# EAGLE design 401_led_1x1 (EAGLE 7.4.0)
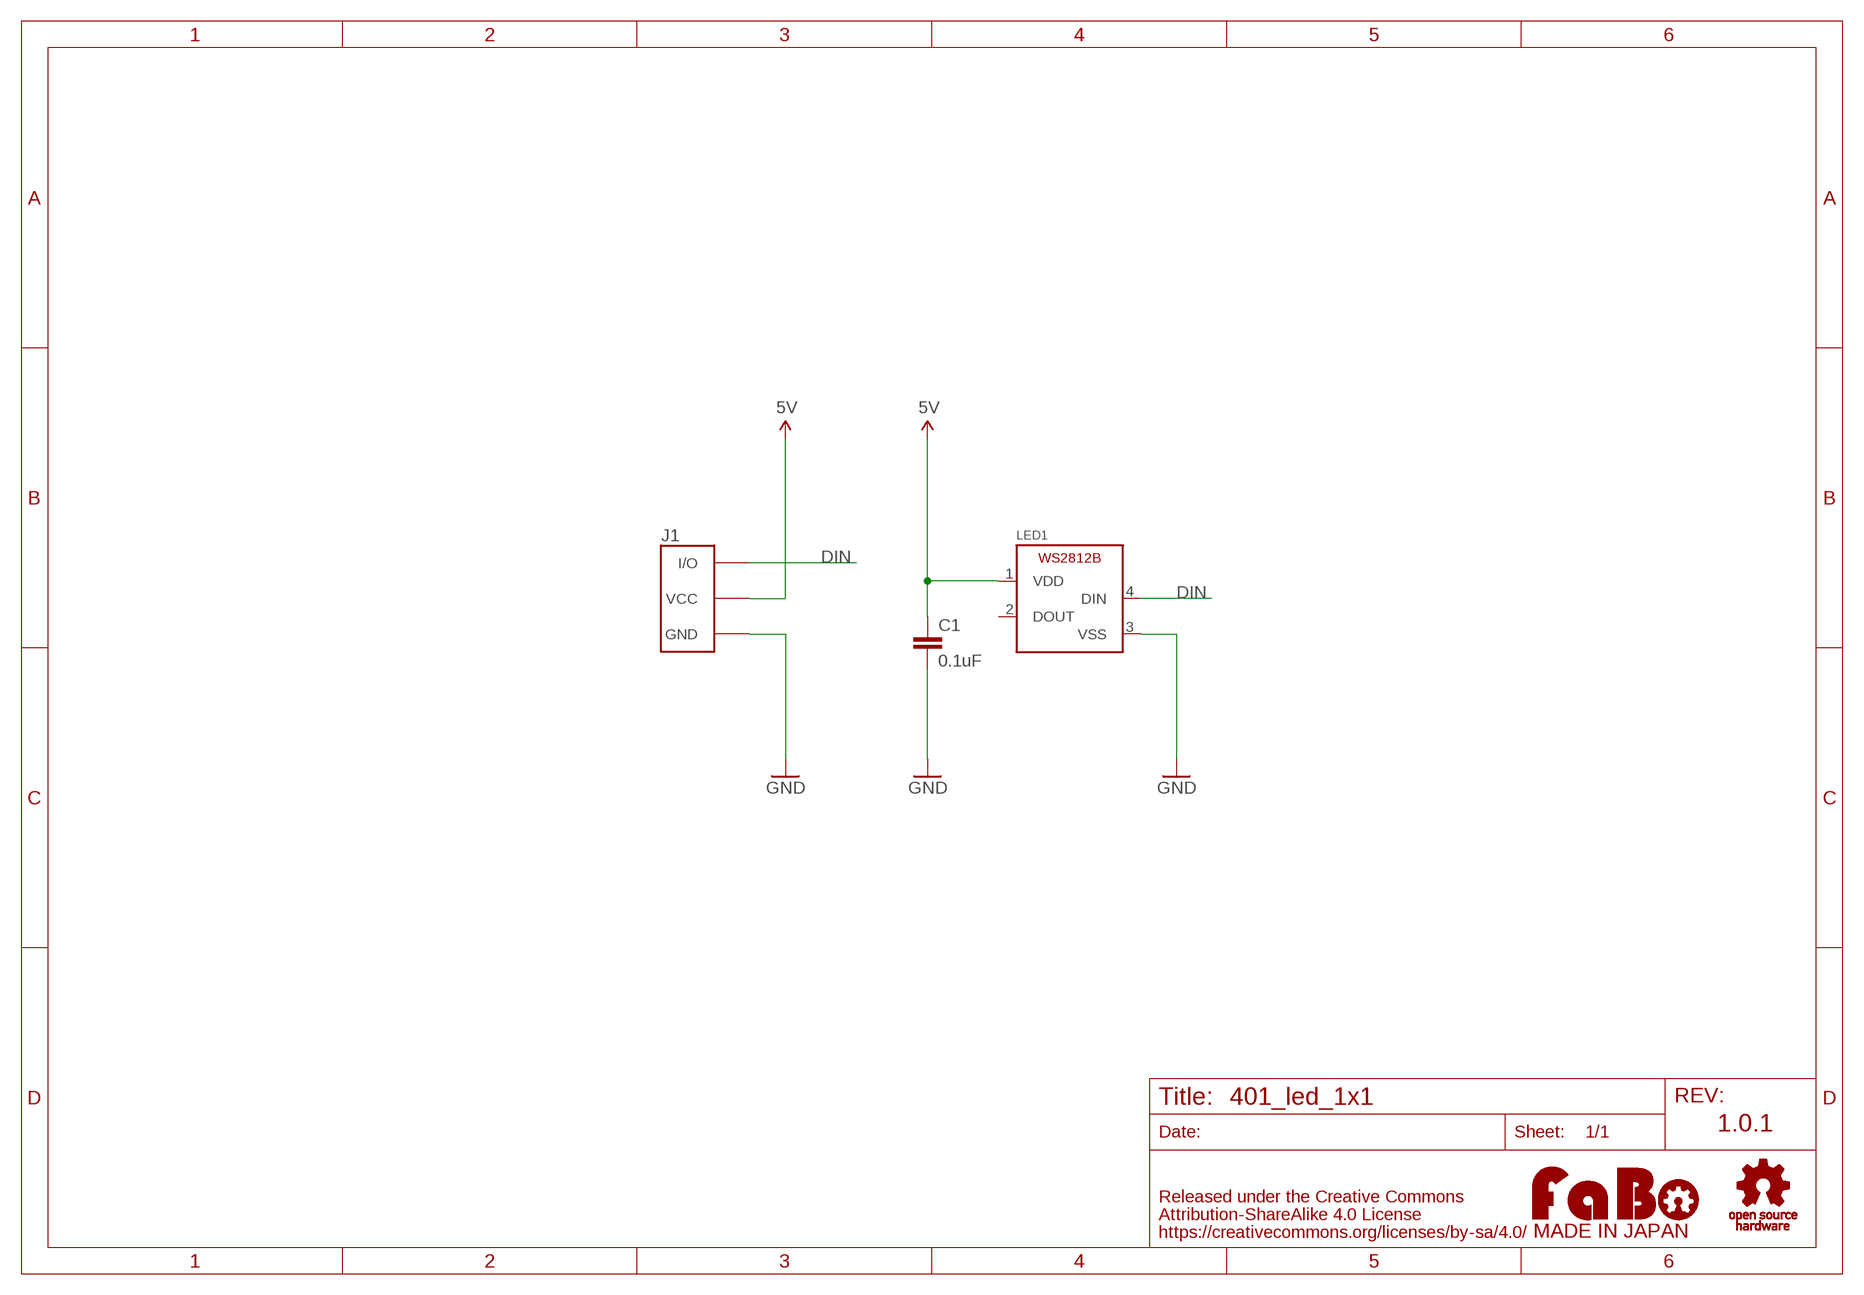
[diagram p0: schematic, sheet 1]

## Parts
C1  0.1uF  CAP-EIA0603  [EIA0603]
J1  FABO_BRICK_3PIN  [FABO_BRICK_3PIN]
LED1  WS2812B  [WS2812B]
U$2  LOGO_OSHW-T_M_BOTTOM  [LOGO_OSHW_T_MS_BOTTOM]
U$3  LOGO_FABO-M  [LOGO_FABO_MS]

## Nets
5V: C1.1 J1.VCC LED1.1(VDD)
DIN: J1.IN/OUT(I/O) LED1.4(DIN)
GND: C1.2 J1.GND LED1.3(VSS)
Unconnected: LED1.2(DOUT)

## Notes on the sheet
- 1.0.1

## Library data of the parts
C1 = FaBo-etc:CAP: Capacitor Standard 0603 ceramic capacitor
J1 = FaBo-Template:FABO_BRICK_3PIN: FaBo Brick 3pin
LED1 = FaBo-LED:WS2812B
U$2 = FaBo-etc:LOGO_OSHW
U$3 = FaBo-etc:LOGO_FABO

## Board
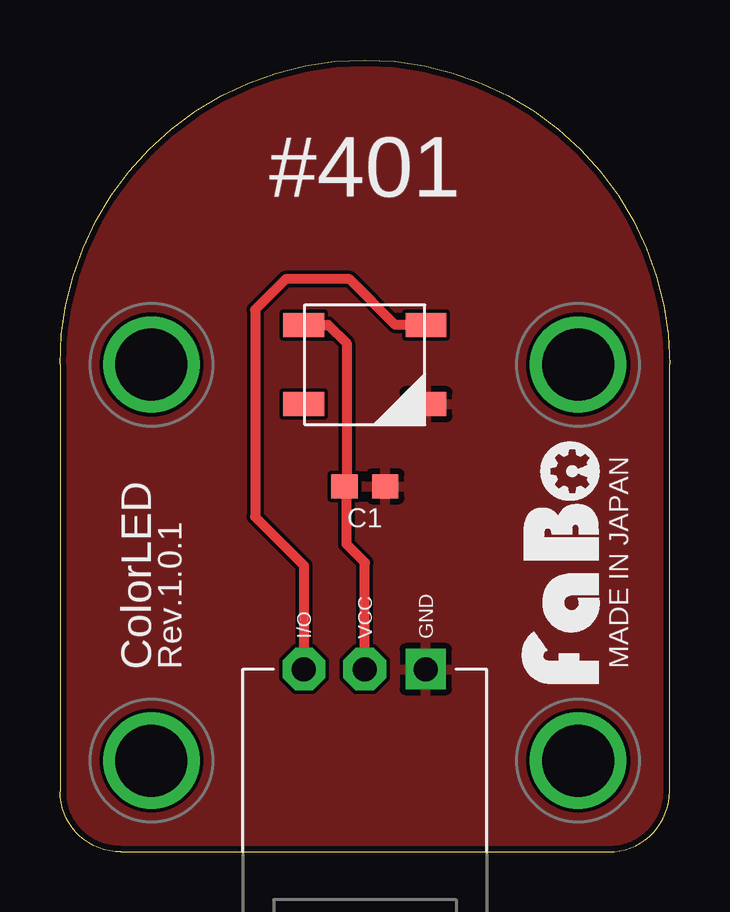
[diagram p1: board, top side]
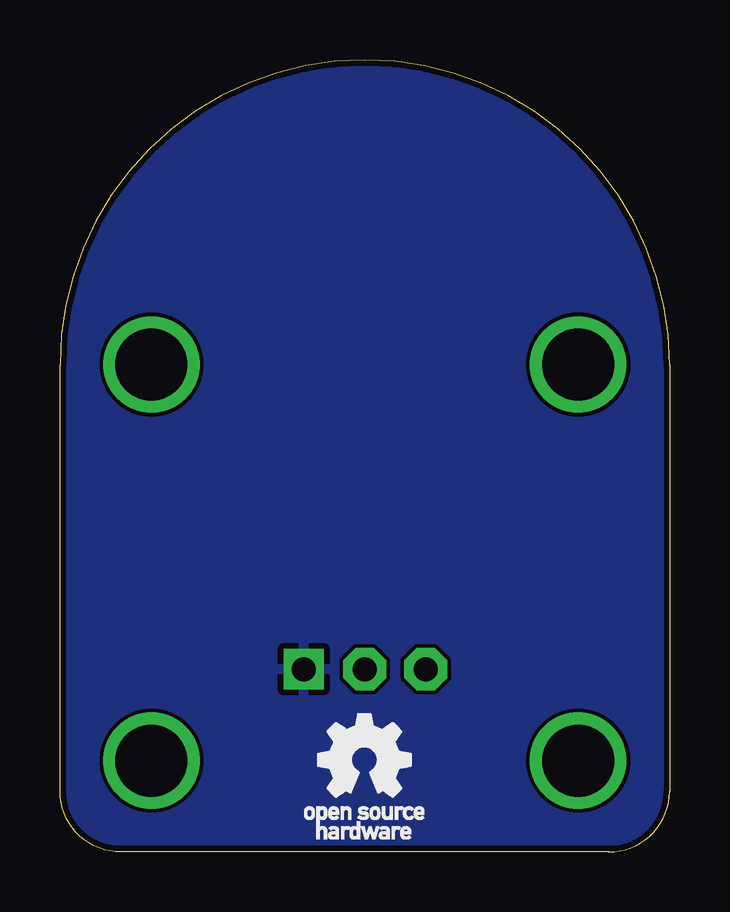
[diagram p2: board, bottom side, seen from below]

Size 25.4 x 33.02 mm. Coordinates in mm from the lower left corner, seen from the top.
Copper layers (1*16): Top 0.035mm / dielectric 1.5mm / Bottom 0.035mm
Design rules "Elecrow_2-layer_eagle_rule": minimum track width 6mil, minimum drill 12mil, track to track 6mil, track to pad 6mil, pad to pad 6mil, via to via 6mil, smd to smd 0mil, copper to edge 10mil, drill to drill 10mil, minimum pad ring 10mil, minimum via ring 6mil, stop-mask expansion 2mil, vias tented up to drill 100mil, thermal gap 10mil

### Footprints (pad centres in the part's own frame; a part is rotated, then mirrored left to right if it is on the bottom)
EIA0603 = smd 1.1 x 1: 1 -0.85,0; 2 0.85,0
FABO_BRICK_3PIN = drill 1 pad 1.676 square: GND 2.54,-8.89 | drill 1 pad 1.778 octagon: IN/OUT -2.54,-8.89; VCC 0,-8.89 | drill 3 pad 3.81: P$5 -8.89,3.81; P$6 8.89,3.81; P$7 -8.89,-12.7; P$8 8.89,-12.7
WS2812B = smd 1.7 x 1: 1 -2.55,1.65; 2 -2.55,-1.65; 3 2.55,-1.65; 4 2.55,1.65

### Placement (x,y rotation side)
C1  12.7,15.24 0 top
J1  12.7,16.51 0 top
LED1  12.7,20.32 0 top
U$2  12.7,3.81 0 top
U$3  22.86,12.06 90 top

### Tracks (layer width: path | path; a pad name or v marks a point on that pad's centre or on a via)
5V
  Top 0.406: J1.VCC 12.7,12.06 11.94,12.83 11.94,15.15 C1.1 11.94,15.33 11.94,21.21 11.18,21.97 LED1.1
DIN
  Top 0.406: LED1.4 13.97,21.97 12.06,23.88 9.4,23.88 8.13,22.61 8.13,13.97 10.16,11.94 J1.IN/OUT
GND
  pour Bottom: -1.27,-1.27 26.67,-1.27 26.67,34.29 -1.27,34.29
  pour Top: -1.27,-1.27 26.67,-1.27 26.67,34.29 -1.27,34.29

### Text on the board
tPlace: #401 | MADE IN JAPAN | ColorLED | Rev.1.0.1